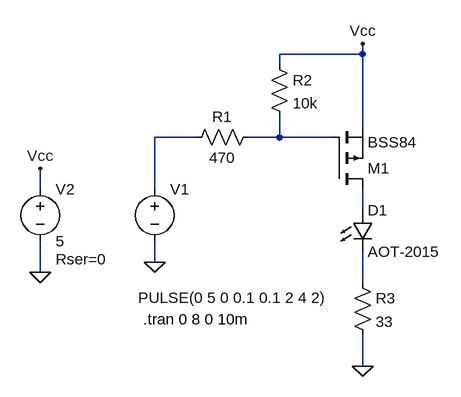
[diagram p0: schematic pmos.asc]
pmos.asc, the LTspice schematic file:
Version 4
SHEET 1 880 680
WIRE 368 -32 368 -48
WIRE 368 -32 240 -32
WIRE 240 -16 240 -32
WIRE 368 80 368 -32
WIRE 112 96 48 96
WIRE 240 96 240 64
WIRE 240 96 192 96
WIRE 320 96 240 96
WIRE -128 176 -128 144
WIRE 48 176 48 96
WIRE 368 208 368 176
WIRE 48 288 48 256
WIRE -128 304 -128 256
WIRE 368 320 368 272
WIRE 368 448 368 400
FLAG 368 448 0
FLAG -128 304 0
FLAG 48 288 0
FLAG -128 144 Vcc
FLAG 368 -48 Vcc
SYMBOL res 208 80 R90
WINDOW 0 0 56 VBottom 2
WINDOW 3 32 56 VTop 2
SYMATTR InstName R1
SYMATTR Value 470
SYMBOL LED 352 208 R0
SYMATTR InstName D1
SYMATTR Value AOT-2015
SYMBOL res 352 304 R0
SYMATTR InstName R3
SYMATTR Value 33
SYMBOL voltage 48 160 R0
WINDOW 3 -25 183 Left 2
WINDOW 123 0 0 Left 0
WINDOW 39 0 0 Left 0
SYMATTR InstName V1
SYMATTR Value PULSE(0 5 0 0.1 0.1 2 4 2)
SYMBOL voltage -128 160 R0
WINDOW 123 0 0 Left 0
WINDOW 39 24 124 Left 2
SYMATTR InstName V2
SYMATTR Value 5
SYMATTR SpiceLine Rser=0
SYMBOL pmos 320 176 M180
SYMATTR InstName M1
SYMATTR Value BSS84
SYMBOL res 224 -32 R0
SYMATTR InstName R2
SYMATTR Value 10k
TEXT 30 376 Left 2 !.tran 0 8 0 10m

The netlist it stands for:
* pmos.asc
R1 N002 N001 470
D1 N003 N004 AOT-2015
R3 N004 0 33
V1 N001 0 PULSE(0 5 0 0.1 0.1 2 4 2)
V2 Vcc 0 5 Rser=0
M1 N003 N002 Vcc Vcc BSS84
R2 Vcc N002 10k
.model D D
.lib standard.dio
.model NMOS NMOS
.model PMOS PMOS
.lib standard.mos
.tran 0 8 0 10m
.backanno
.end